# EAGLE schematic sensor (EAGLE 9.4.2)

## Sheet 1 of 2
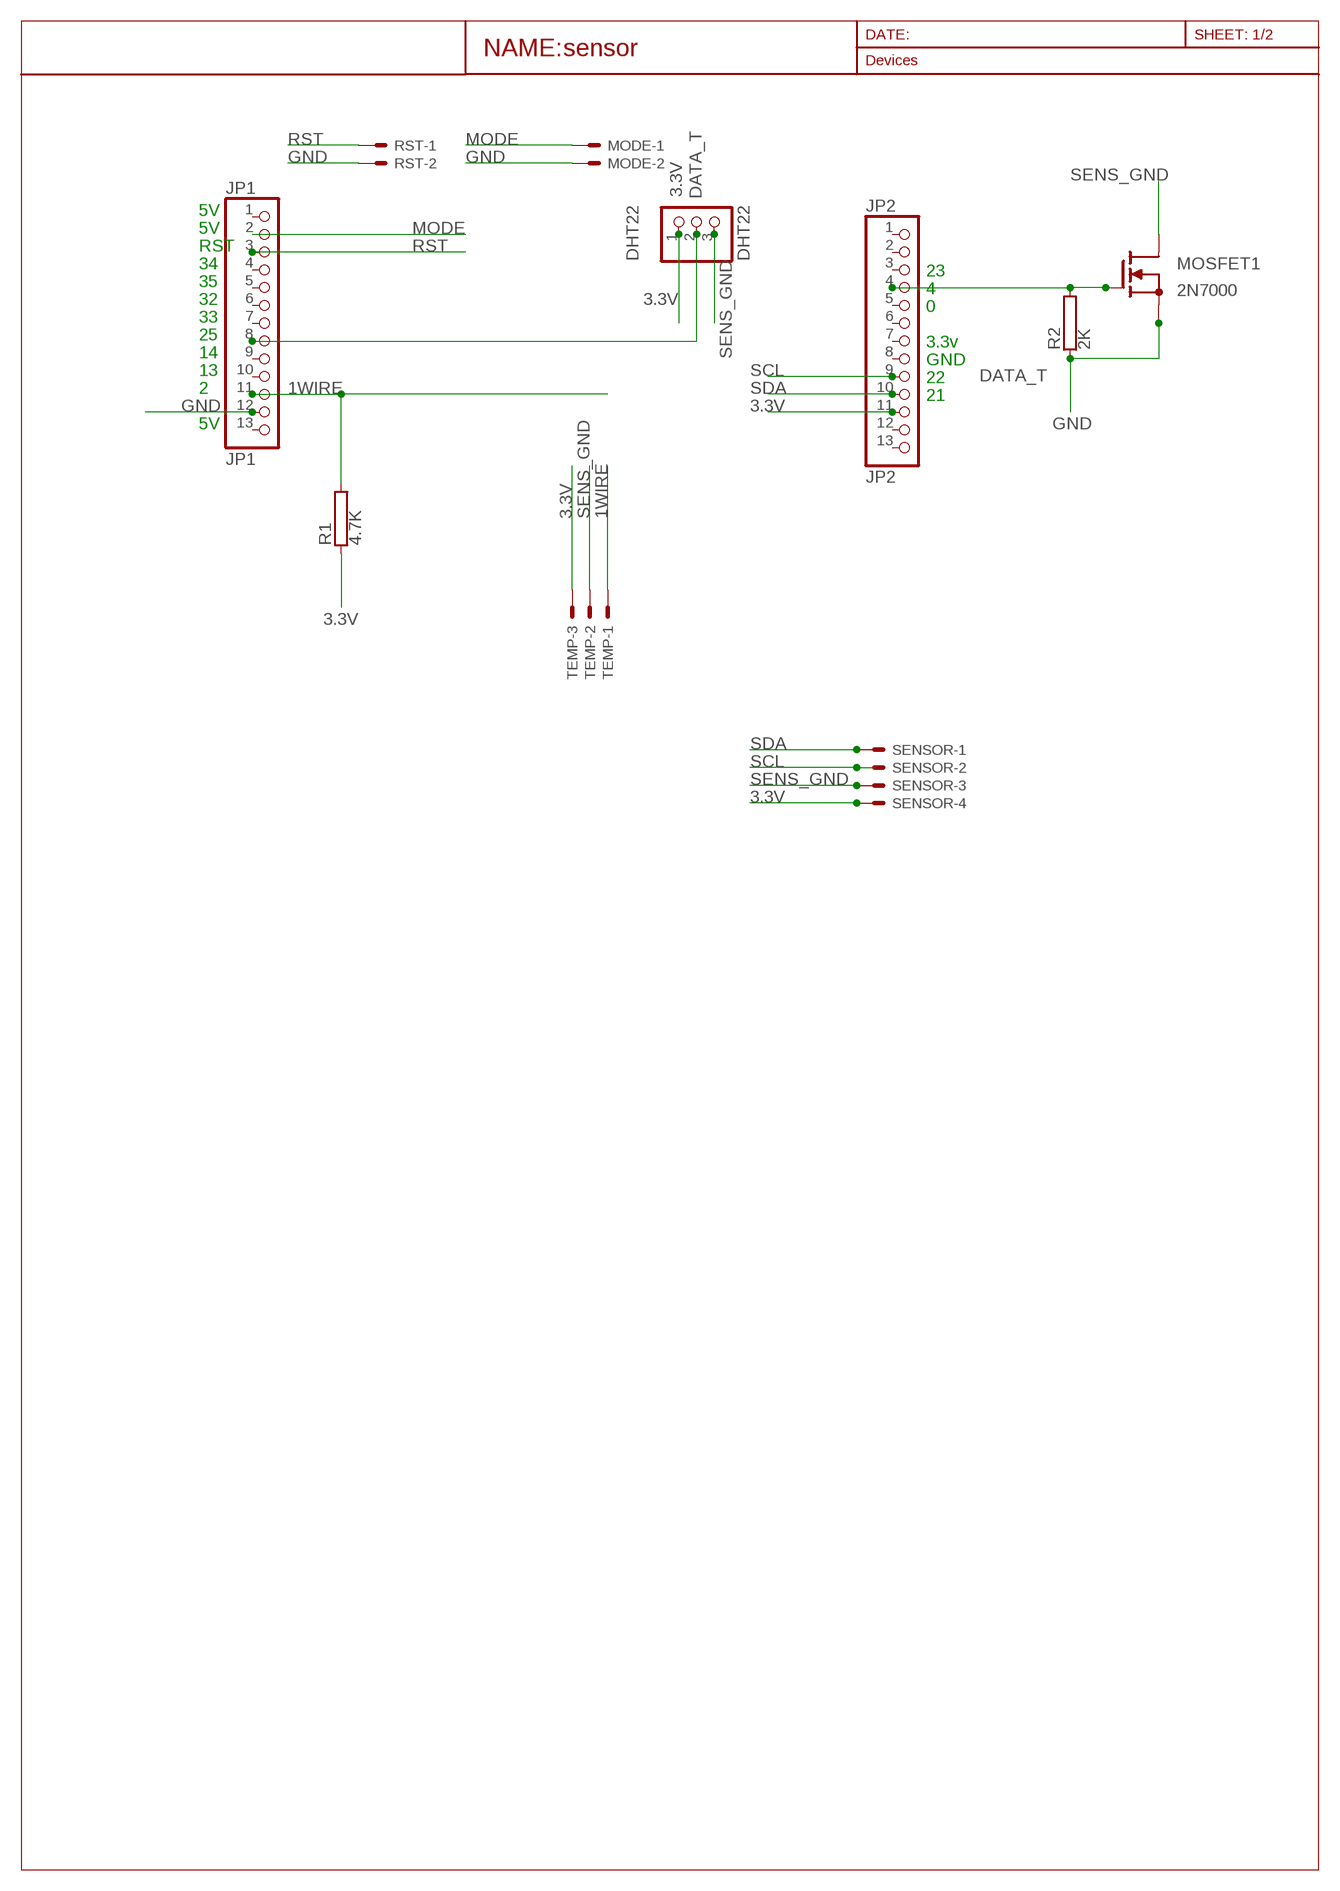
[diagram p0: schematic, sheet 1]

### Parts
DHT22  DHT22  PINHD-1X3  [1X03]
JP1  JP1  PINHD-1X13  [1X13]
JP2  JP2  PINHD-1X13  [1X13]
MODE  JST-XH-02-PIN-LONG-PAD  [JST-XH-02-PACKAGE-LONG-PAD]
MOSFET1  2N7000  [TO92]
R1  4.7K  RHPS58  [HPS58]
R2  2K  RHPS58  [HPS58]
RST  JST-XH-02-PIN-LONG-PAD  [JST-XH-02-PACKAGE-LONG-PAD]
SENSOR  JST-XH-04-PIN-LONG-PAD  [JST-XH-04-PACKAGE-LONG-PAD]
TEMP  JST-XH-03-PIN-LONG-PAD  [JST-XH-03-PACKAGE-LONG-PAD]

### Nets
1WIRE [pwr]: JP1.11 R1.2 TEMP.1
3.3V [pwr]: DHT22.1 JP2.11 R1.1 SENSOR.4 TEMP.3
DATA_T [pwr]: DHT22.2 JP1.8
GND [pwr]: JP1.12 MODE.2 MOSFET1.C(S) R2.1 RST.2
MODE [pwr]: JP1.2 MODE.1
RST [pwr]: JP1.3 RST.1
SCL [pwr]: JP2.9 SENSOR.2
SDA [pwr]: JP2.10 SENSOR.1
SENS_ENABLE [pwr]: JP2.4 MOSFET1.B(G) R2.2
SENS_GND [pwr]: DHT22.3 MOSFET1.E(D) SENSOR.3 TEMP.2
Unconnected: JP1.1 JP1.4 JP1.5 JP1.6 JP1.7 JP1.9 JP1.10 JP1.13 JP2.1 JP2.2 JP2.3 JP2.5 JP2.6 JP2.7 JP2.8 JP2.12 JP2.13

### Notes on the sheet
- 5V
- 5V
- RST
- 34
- 23
- 35
- 4
- 32
- 0
- 33
- 25
- 3.3v
- 14
- GND
- 13
- 22
- 2
- 21
- 5V

## Sheet 2 of 2

## Library data of the parts
DHT22 = adafruit:PINHD-1X3: PIN HEADER
JP1 JP2 = adafruit:PINHD-1X13: PIN HEADER
MODE RST = Rembrandt Electronics - JST XH Connectors v1-0:JST-XH-02-PIN: JST XH Connector 2 Pin Wire to board connector. Pitch: 2,54 mm, (0.100") Number of pins: 2 Created by Rembrandt Electronics www.rembrandtelectronics.com
MOSFET1 = 2N7000:2N7000; AVAILABILITY: Unavailable; DESCRIPTION: MOSFETs- Power and Small Signal 60V 200mA N-Channel No-Cancel/No-Return; MF: STMicroelectronics; MP: 2N7000; PACKAGE: TO-92 ON Semiconductor; PRICE: None
R1 R2 = resistor-power:R: Power Resitor; OC_FARNELL: unknown; OC_NEWARK: unknown
SENSOR = Rembrandt Electronics - JST XH Connectors v1-0:JST-XH-04-PIN: JST XH Connector 2 Pin Wire to board connector. Pitch: 2,54 mm, (0.100") Number of pins: 4 Created by Rembrandt Electronics www.rembrandtelectronics.com
TEMP = Rembrandt Electronics - JST XH Connectors v1-0:JST-XH-03-PIN: JST XH Connector 2 Pin Wire to board connector. Pitch: 2,54 mm, (0.100") Number of pins: 3 Created by Rembrandt Electronics www.rembrandtelectronics.com

## Module SWITCHES
Ports: 

### Library data of the parts

## Module POWER
Ports: VCC(io) 3.3V(io) GND(io) ENABLE(io)

### Library data of the parts

## Net classes
1 pwr: width 0.6 mm